# Altium schematic sheet F407VET6.SchDoc
size A4; SheetNumber: 1; SheetTotal: 1
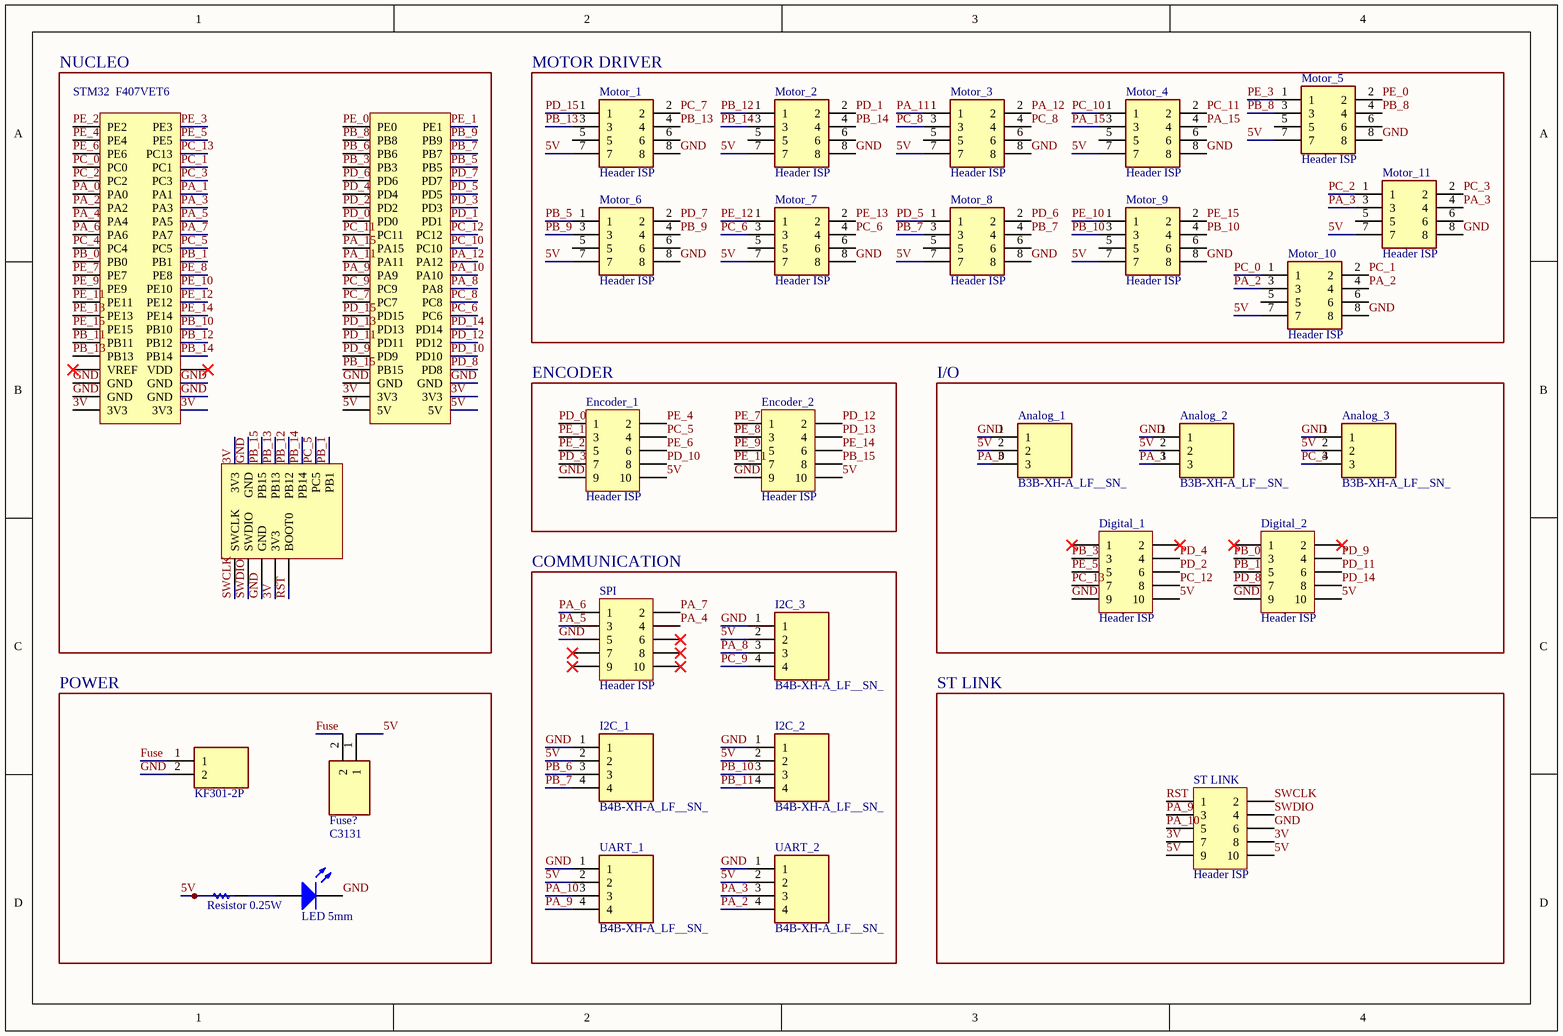
[diagram p0: F407VET6.SchDoc]

## Parts
*  STM32  F407VET6  [MICON]
Analog_1  B3B-XH-A_LF__SN_  [B3BXHALFSN]
Analog_2  B3B-XH-A_LF__SN_  [B3BXHALFSN]
Analog_3  B3B-XH-A_LF__SN_  [B3BXHALFSN]
Digital_1  Header ISP  [Header ISP]
Digital_2  Header ISP  [Header ISP]
Encoder_1  Header ISP  [Header ISP]
Encoder_2  Header ISP  [Header ISP]
Fuse?  C3131  [C3131]
I2C_1  B4B-XH-A_LF__SN_  [B4BXHALFSN]
I2C_2  B4B-XH-A_LF__SN_  [B4BXHALFSN]
I2C_3  B4B-XH-A_LF__SN_  [B4BXHALFSN]
led?  LED 5mm  [LED 5mm]
Motor_1  Header ISP  [09181089622]
Motor_2  Header ISP  [09181089622]
Motor_3  Header ISP  [09181089622]
Motor_4  Header ISP  [09181089622]
Motor_5  Header ISP  [09181089622]
Motor_6  Header ISP  [09181089622]
Motor_7  Header ISP  [09181089622]
Motor_8  Header ISP  [09181089622]
Motor_9  Header ISP  [09181089622]
Motor_10  Header ISP  [09181089622]
Motor_11  Header ISP  [09181089622]
Power?  KF301-2P  [KF3012P]
R?  Resistor 0.25W  [Resistor 0.25W]
SPI  Header ISP  [Header ISP]
ST_LINK  Header ISP  [Header ISP]
UART_1  B4B-XH-A_LF__SN_  [B4BXHALFSN]
UART_2  B4B-XH-A_LF__SN_  [B4BXHALFSN]

## Blocks framed on the sheet
NUCLEO: *
MOTOR DRIVER: Motor_1-Motor_11
ENCODER: Encoder_1 Encoder_2
I/O: Analog_1-Analog_3 Digital_1 Digital_2
COMMUNICATION: I2C_1-I2C_3 SPI UART_1 UART_2
POWER: Fuse? led? Power? R?
ST LINK: ST_LINK

## Nets
3V: *.3V3 ST_LINK.7 ST_LINK.8
5V: *.5V Analog_1.2 Analog_2.2 Analog_3.2 Digital_1.10 Digital_2.10 Encoder_1.10 Encoder_2.10 Fuse?.1 I2C_1.2 I2C_2.2 I2C_3.2 Motor_1.7 Motor_2.7 Motor_3.7 Motor_4.7 Motor_5.7 Motor_6.7 Motor_7.7 Motor_8.7 Motor_9.7 Motor_10.7 Motor_11.7 R?.1 ST_LINK.9 ST_LINK.10 UART_1.2 UART_2.2
Fuse: Fuse?.2 Power?.1
GND: *.GND Analog_1.1 Analog_2.1 Analog_3.1 Digital_1.9 Digital_2.9 Encoder_1.9 Encoder_2.9 I2C_1.1 I2C_2.1 I2C_3.1 led?.2(K) Motor_1.8 Motor_2.8 Motor_3.8 Motor_4.8 Motor_5.8 Motor_6.8 Motor_7.8 Motor_8.8 Motor_9.8 Motor_10.8 Motor_11.8 Power?.2 SPI.5 ST_LINK.6 UART_1.1 UART_2.1
PA_0: *.PA0 Analog_1.3
PA_1: *.PA1 Analog_2.3
PA_2: *.PA2 Motor_10.3 Motor_10.4 UART_2.4
PA_3: *.PA3 Motor_11.3 Motor_11.4 UART_2.3
PA_4: *.PA4 SPI.4
PA_5: *.PA5 SPI.3
PA_6: *.PA6 SPI.1
PA_7: *.PA7 SPI.2
PA_8: *.PA8 I2C_3.3
PA_9: *.PA9 ST_LINK.3 UART_1.4
PA_10: *.PA10 ST_LINK.5 UART_1.3
PA_11: *.PA11 Motor_3.1
PA_12: *.PA12 Motor_3.2
PA_15: *.PA15 Motor_4.3 Motor_4.4
PB_0: *.PB0 Digital_2.3
PB_1: *.PB1 Digital_2.5
PB_3: *.PB3 Digital_1.3
PB_5: *.PB5 Motor_6.1
PB_6: *.PB6 I2C_1.3
PB_7: *.PB7 I2C_1.4 Motor_8.3 Motor_8.4
PB_8: *.PB8 Motor_5.3 Motor_5.4
PB_9: *.PB9 Motor_6.3 Motor_6.4
PB_10: *.PB10 I2C_2.3 Motor_9.3 Motor_9.4
PB_11: *.PB11 I2C_2.4
PB_12: *.PB12 Motor_2.1
PB_13: *.PB13 Motor_1.3 Motor_1.4
PB_14: *.PB14 Motor_2.3 Motor_2.4
PB_15: *.PB15 Encoder_2.8
PC_0: *.PC0 Motor_10.1
PC_1: *.PC1 Motor_10.2
PC_2: *.PC2 Motor_11.1
PC_3: *.PC3 Motor_11.2
PC_4: *.PC4 Analog_3.3
PC_5: *.PC5 Encoder_1.4
PC_6: *.PC6 Motor_7.3 Motor_7.4
PC_7: *.PC7 Motor_1.2
PC_8: *.PC8 Motor_3.3 Motor_3.4
PC_9: *.PC9 I2C_3.4
PC_10: *.PC10 Motor_4.1
PC_11: *.PC11 Motor_4.2
PC_12: *.PC12 Digital_1.8
PC_13: *.PC13 Digital_1.7
PD_0: *.PD0 Encoder_1.1
PD_1: *.PD1 Motor_2.2
PD_2: *.PD2 Digital_1.6
PD_3: *.PD3 Encoder_1.7
PD_4: *.PD4 Digital_1.4
PD_5: *.PD5 Motor_8.1
PD_6: *.PD6 Motor_8.2
PD_7: *.PD7 Motor_6.2
PD_8: *.PD8 Digital_2.7
PD_9: *.PD9 Digital_2.4
PD_10: *.PD10 Encoder_1.8
PD_11: *.PD11 Digital_2.6
PD_12: *.PD12 Encoder_2.2
PD_13: *.PD13 Encoder_2.4
PD_14: *.PD14 Digital_2.8
PD_15: *.PD15 Motor_1.1
PE_0: *.PE0 Motor_5.2
PE_1: *.PE1 Encoder_1.3
PE_2: *.PE2 Encoder_1.5
PE_3: *.PE3 Motor_5.1
PE_4: *.PE4 Encoder_1.2
PE_5: *.PE5 Digital_1.5
PE_6: *.PE6 Encoder_1.6
PE_7: *.PE7 Encoder_2.1
PE_8: *.PE8 Encoder_2.3
PE_9: *.PE9 Encoder_2.5
PE_10: *.PE10 Motor_9.1
PE_11: *.PE11 Encoder_2.7
PE_12: *.PE12 Motor_7.1
PE_13: *.PE13 Motor_7.2
PE_14: *.PE14 Encoder_2.6
PE_15: *.PE15 Motor_9.2
RST: *.BOOT0 ST_LINK.1
SWCLK: *.SWCLK ST_LINK.2
SWDIO: *.SWDIO ST_LINK.4
Netled?_1: led?.1(A) R?.2

Not connected (* = marked no-connect by the designer): * VDD* VREF*; Digital_1 1* 2*; Digital_2 1* 2*; Motor_1 5 6; Motor_2 5 6; Motor_3 5 6; Motor_4 5 6; Motor_5 5 6; Motor_6 5 6; Motor_7 5 6; Motor_8 5 6; Motor_9 5 6; Motor_10 5 6; Motor_11 5 6; SPI 6* 7* 8* 9* 10*

## Library data of the parts
* = Micon?: STM32F407VET6
Analog_1-Analog_3 = B3B-XH-A_LF__SN_: Connector; Manufacturer_Name: JST (JAPAN SOLDERLESS TERMINALS); Manufacturer_Part_Number: B3B-XH-A(LF)(SN); Datasheet Link: https://datasheet.lcsc.com/szlcsc/1812131720_JST-Sales-America-B3B-XH-A-LF-SN_C144394.pdf; Height: 7mm; Arrow Part Number: B3B-XH-A(LF)(SN); Arrow Price/Stock: https://www.arrow.com/en/products/b3b-xh-a-lf-sn/jst-manufacturing?region=europe
Fuse? = C3131: Undefined or Miscellaneous; Manufacturer_Name: Xucheng Elec; Datasheet Link: https://datasheet.lcsc.com/szlcsc/XC-Elec-Shenzhen-5x20-BLX-Fuse-holder_C3131.pdf; Height: 10.5mm; Manufacturer_Part_Number: C3131
I2C_1-I2C_3 UART_1 UART_2 = B4B-XH-A_LF__SN_: Connector; Manufacturer_Name: JST (JAPAN SOLDERLESS TERMINALS); Manufacturer_Part_Number: B4B-XH-A(LF)(SN); Datasheet Link: https://datasheet.lcsc.com/szlcsc/JST-Sales-America-B4B-XH-A-LF-SN_C144395.pdf; Height: 7mm; Arrow Part Number: B4B-XH-A(LF)(SN); Arrow Price/Stock: https://www.arrow.com/en/products/b4b-xh-a-lf-sn/jst-manufacturing
Motor_1-Motor_11 = 09181089622: Connector; Manufacturer_Name: HARTING; Datasheet Link: http://uk.rs-online.com/web/p/products/6935182; Height: 5.5mm; Manufacturer_Part_Number: 09181089622; Mouser Part Number: 617-09181089622; Mouser Price/Stock: https://www.mouser.co.uk/ProductDetail/HARTING/09181089622?qs=FeiuqfHlVTv2CjJEejdN9Q%3D%3D
Power? = KF301-2P: Connector; Manufacturer_Name: Handson Technology; Datasheet Link: http://www.handsontec.com/dataspecs/terminal%20block-5mm.pdf; Height: 10mm; Manufacturer_Part_Number: KF301-2P